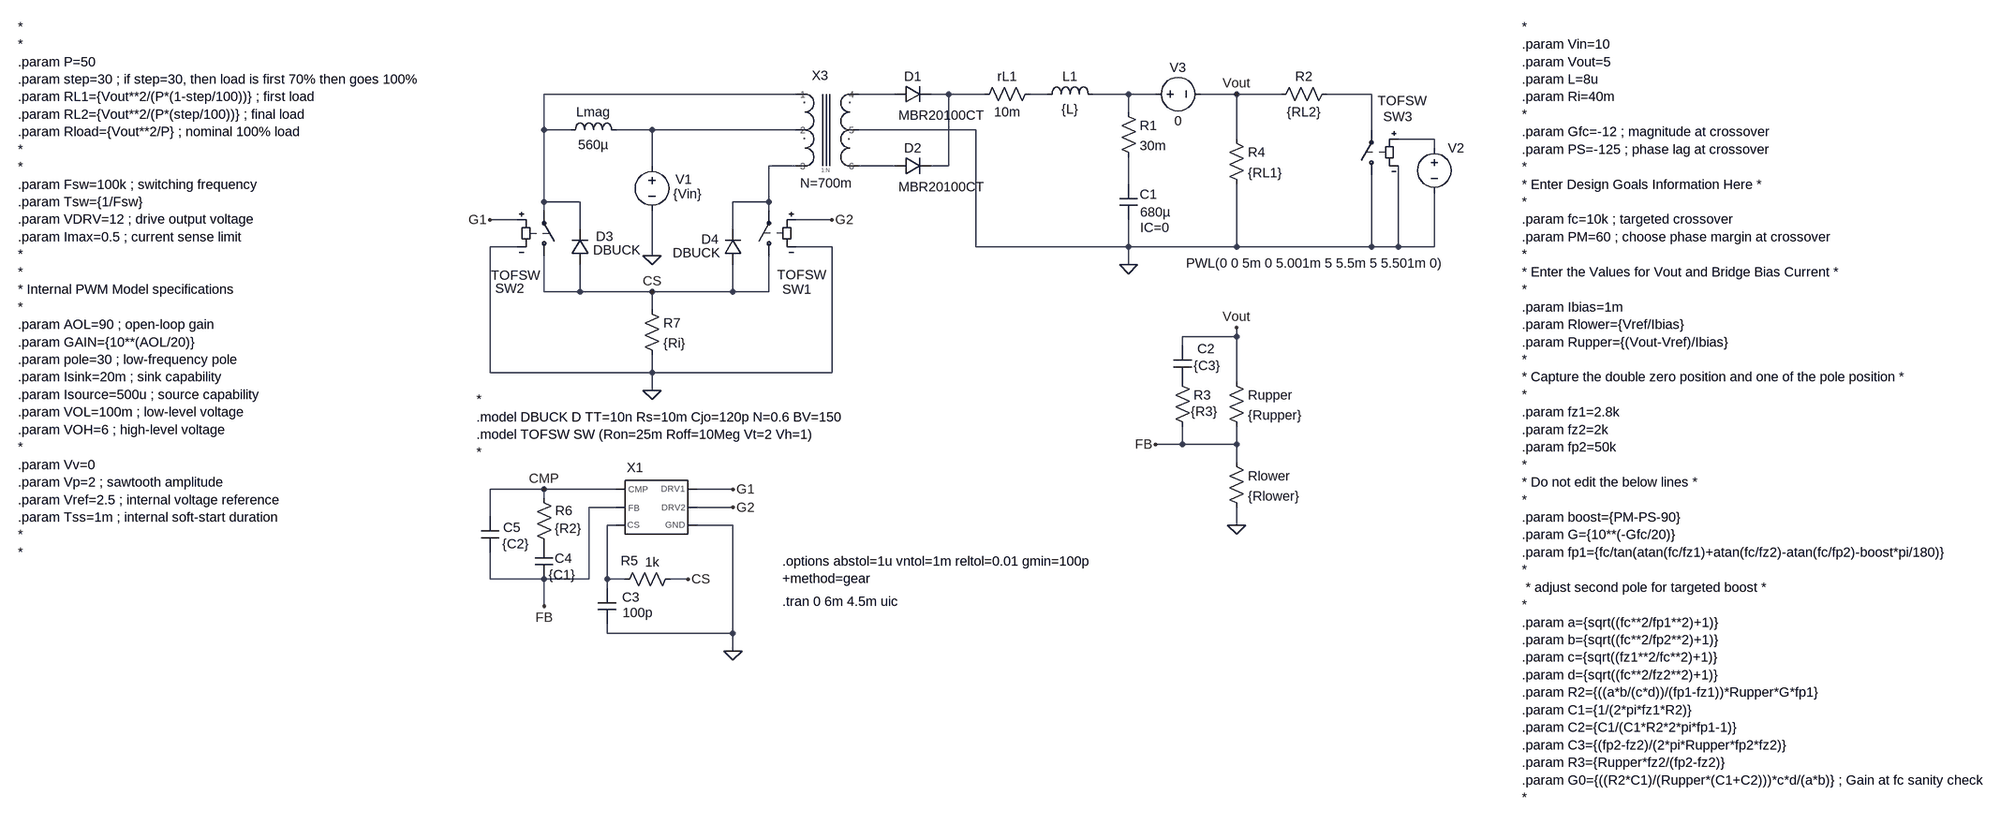
[diagram p0: schematic Push-pull VM - cbc - load step.asc]
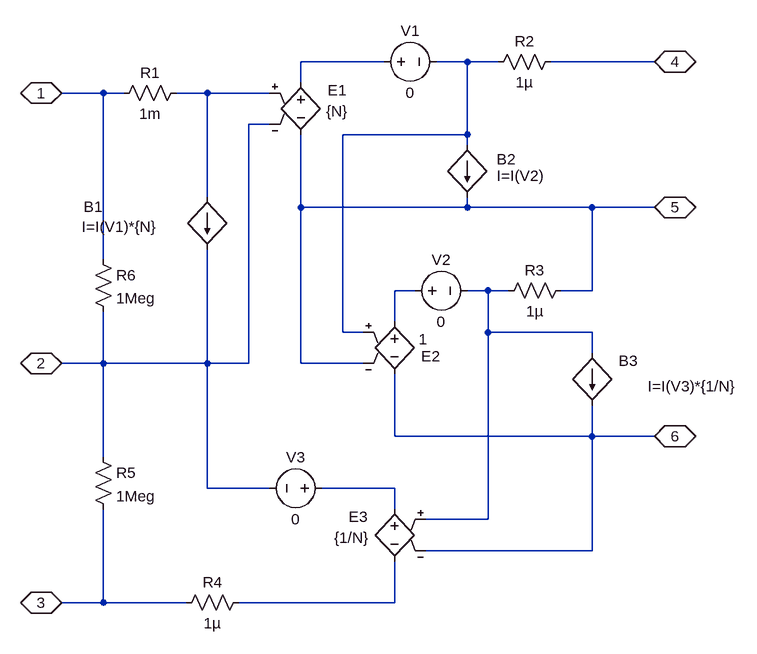
[diagram p1: sub-circuit xfmr_ctap2.asc]
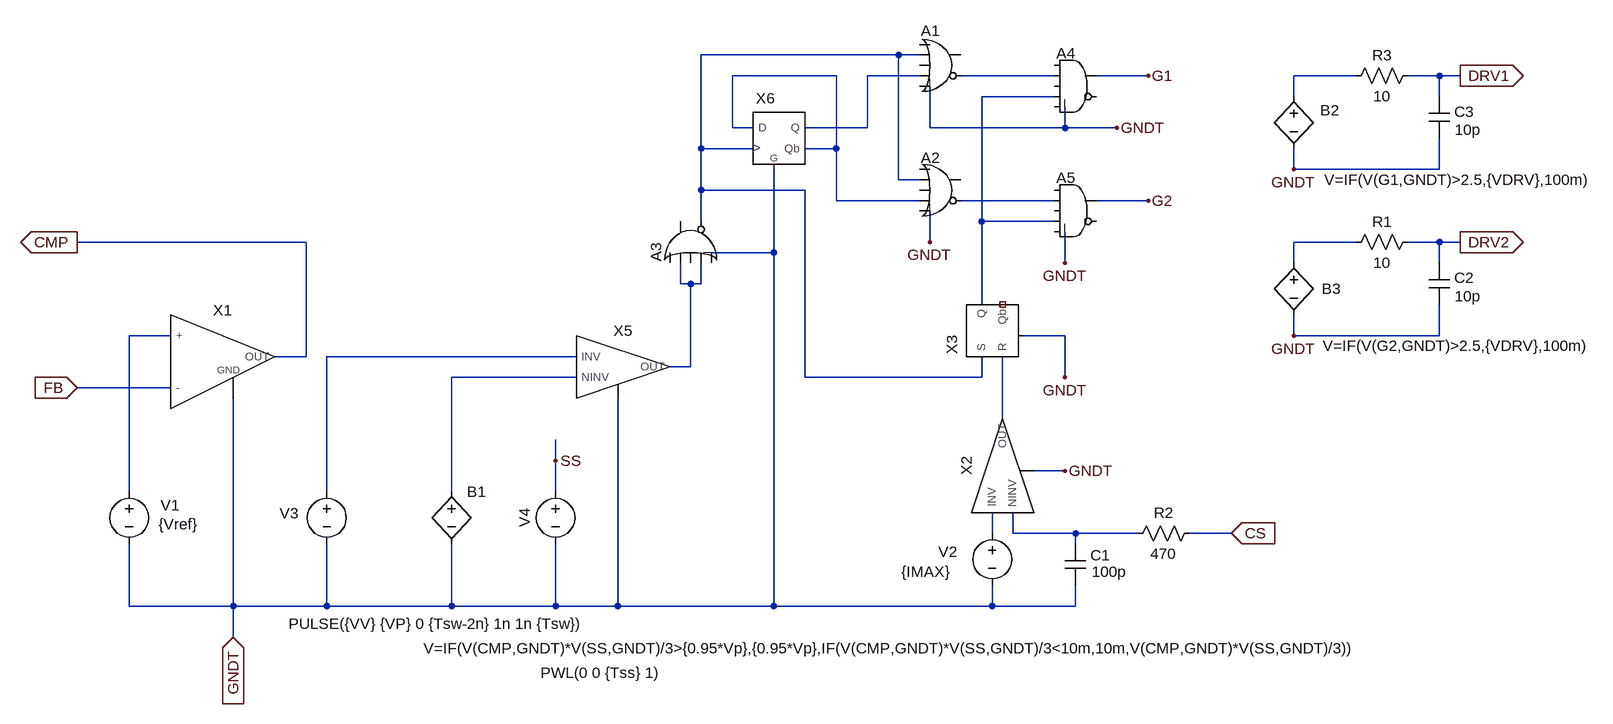
[diagram p2: sub-circuit generic_push_vm_pwm.asc]
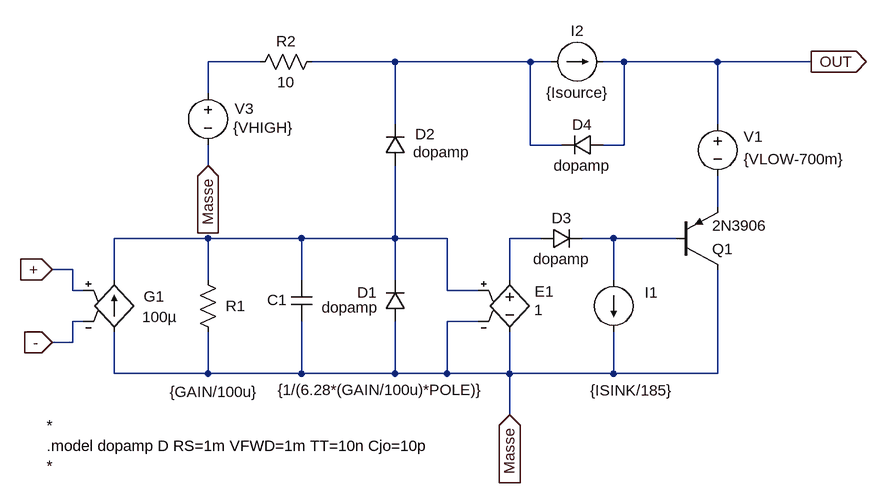
[diagram p3: sub-circuit op_amp_fan_out.asc]
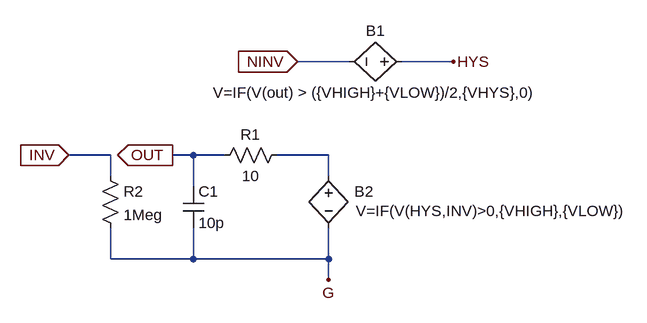
[diagram p4: sub-circuit comptof_g.asc]
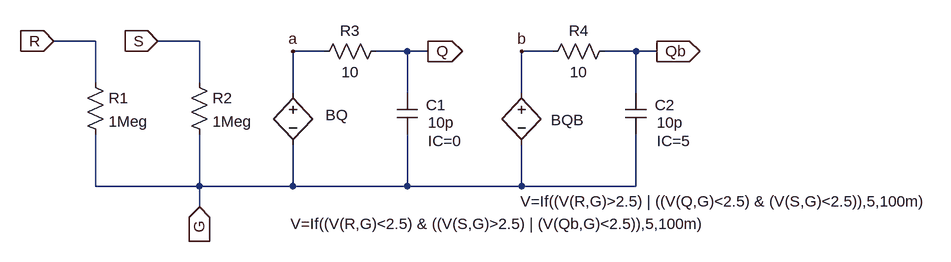
[diagram p5: sub-circuit sr_latch_g.asc]
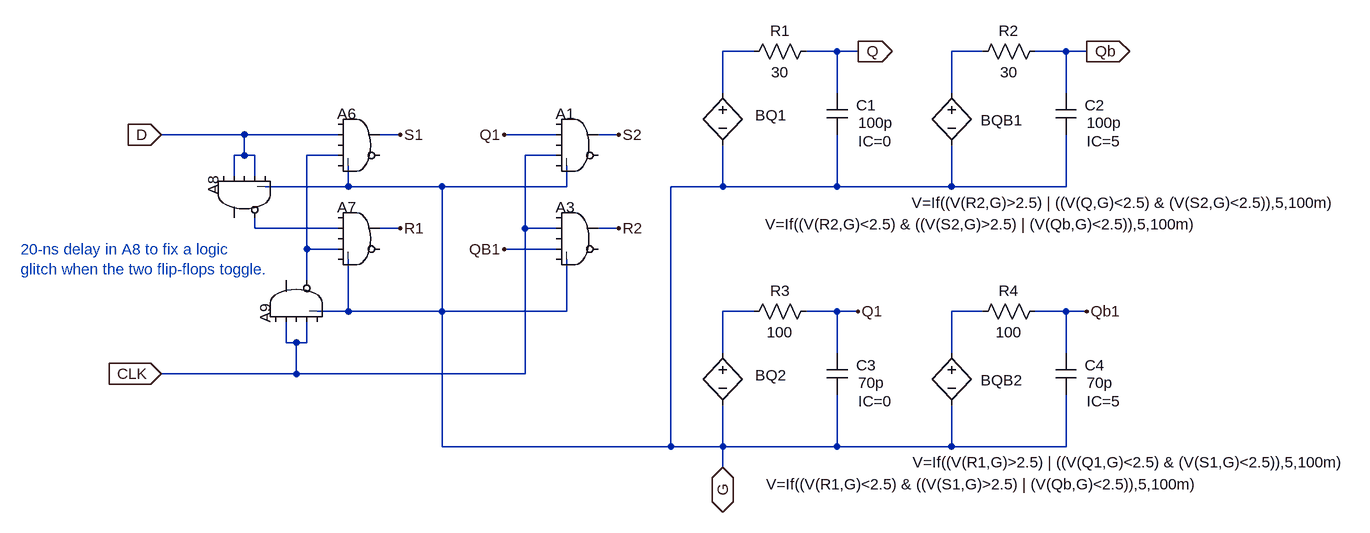
[diagram p6: sub-circuit d_flipflop_g.asc]
Push-pull VM - cbc - load step.asc, the LTspice schematic file:
Version 4.1
SHEET 1 2472 1388
WIRE 32 -64 -416 -64
WIRE 208 -64 144 -64
WIRE 304 -64 272 -64
WIRE 368 -64 304 -64
WIRE 480 -64 448 -64
WIRE 624 -64 560 -64
WIRE 672 -64 624 -64
WIRE 816 -64 752 -64
WIRE 896 -64 816 -64
WIRE 1056 -64 976 -64
WIRE 624 -32 624 -64
WIRE -416 0 -416 -64
WIRE -368 0 -416 0
WIRE -224 0 -288 0
WIRE 32 0 -224 0
WIRE 352 0 144 0
WIRE 1056 0 1056 -64
WIRE 816 16 816 -64
WIRE 1168 16 1104 16
WIRE 1168 32 1168 16
WIRE -224 64 -224 0
WIRE 32 64 -16 64
WIRE 208 64 144 64
WIRE 304 64 304 -64
WIRE 304 64 272 64
WIRE 624 96 624 48
WIRE -416 128 -416 0
WIRE -352 128 -416 128
WIRE -16 128 -16 64
WIRE -16 128 -80 128
WIRE -416 144 -416 128
WIRE -16 144 -16 128
WIRE -464 160 -512 160
WIRE 96 160 32 160
WIRE -352 176 -352 128
WIRE -80 176 -80 128
WIRE -464 208 -512 208
WIRE 96 208 32 208
WIRE 352 208 352 0
WIRE 624 208 624 160
WIRE 624 208 352 208
WIRE 816 208 816 96
WIRE 816 208 624 208
WIRE 1056 208 1056 80
WIRE 1056 208 816 208
WIRE 1104 208 1104 64
WIRE 1104 208 1056 208
WIRE 1168 208 1168 112
WIRE 1168 208 1104 208
WIRE -224 224 -224 144
WIRE 624 240 624 208
WIRE -416 288 -416 224
WIRE -352 288 -352 240
WIRE -352 288 -416 288
WIRE -224 288 -352 288
WIRE -80 288 -80 240
WIRE -80 288 -224 288
WIRE -16 288 -16 224
WIRE -16 288 -80 288
WIRE -224 320 -224 288
WIRE 816 368 816 352
WIRE 816 368 720 368
WIRE 720 384 720 368
WIRE -512 432 -512 208
WIRE -224 432 -224 400
WIRE -224 432 -512 432
WIRE 96 432 96 208
WIRE 96 432 -224 432
WIRE 816 448 816 368
WIRE -224 464 -224 432
WIRE 720 560 720 528
WIRE 720 560 672 560
WIRE 816 560 816 528
WIRE 816 560 720 560
WIRE 816 592 816 560
WIRE -416 640 -512 640
WIRE -288 640 -416 640
WIRE -80 640 -144 640
WIRE -416 656 -416 640
WIRE -288 672 -336 672
WIRE -80 672 -144 672
WIRE -512 688 -512 640
WIRE -288 704 -304 704
WIRE -80 704 -144 704
WIRE 816 704 816 672
WIRE -512 800 -512 752
WIRE -416 800 -512 800
WIRE -336 800 -336 672
WIRE -336 800 -416 800
WIRE -304 800 -304 704
WIRE -272 800 -304 800
WIRE -160 800 -192 800
WIRE -304 816 -304 800
WIRE -416 848 -416 800
WIRE -304 896 -304 880
WIRE -80 896 -80 704
WIRE -80 896 -304 896
WIRE -80 928 -80 896
FLAG 816 704 0
FLAG 816 352 Vout
FLAG 624 240 0
FLAG -224 224 0
FLAG -512 160 G1
FLAG 96 160 G2
FLAG 816 -64 Vout
FLAG -416 848 FB
FLAG -80 928 0
FLAG -416 640 CMP
FLAG -224 464 0
FLAG -80 640 G1
FLAG -80 672 G2
FLAG -224 288 CS
FLAG -160 800 CS
FLAG 672 560 FB
SYMBOL sw -16 240 R180
WINDOW 3 -102 -18 Left 2
WINDOW 0 -76 -44 Left 2
SYMATTR Value TOFSW
SYMATTR InstName SW1
SYMBOL voltage -224 48 R0
WINDOW 0 42 40 Left 2
WINDOW 3 38 66 Left 2
SYMATTR InstName V1
SYMATTR Value {Vin}
SYMBOL diode 208 -48 R270
WINDOW 0 32 32 VTop 2
WINDOW 3 -6 83 VBottom 2
SYMATTR InstName D1
SYMATTR Value MBR20100CT
SYMBOL res 464 -80 R90
WINDOW 0 0 56 VBottom 2
WINDOW 3 32 56 VTop 2
SYMATTR InstName rL1
SYMATTR Value 10m
SYMBOL ind 464 -48 R270
WINDOW 0 32 56 VTop 2
WINDOW 3 5 56 VBottom 2
SYMATTR InstName L1
SYMATTR Value {L}
SYMBOL res 608 -48 R0
SYMATTR InstName R1
SYMATTR Value 30m
SYMBOL cap 608 96 R0
WINDOW 0 36 19 Left 2
WINDOW 3 37 50 Left 2
WINDOW 123 37 78 Left 2
SYMATTR InstName C1
SYMATTR Value 680µ
SYMATTR Value2 IC=0
SYMBOL res 800 576 R0
SYMATTR InstName Rlower
SYMATTR Value {Rlower}
SYMBOL res 800 432 R0
SYMATTR InstName Rupper
SYMATTR Value {Rupper}
SYMBOL cap 704 384 R0
WINDOW 0 42 6 Left 2
WINDOW 3 36 36 Left 2
SYMATTR InstName C2
SYMATTR Value {C3}
SYMBOL res 704 432 R0
WINDOW 3 31 69 Left 2
SYMATTR Value {R3}
SYMATTR InstName R3
SYMBOL sw -416 240 M180
WINDOW 3 -7 -19 Right 2
WINDOW 0 -35 -42 Right 2
SYMATTR Value TOFSW
SYMATTR InstName SW2
SYMBOL diode 208 80 R270
WINDOW 0 32 32 VTop 2
WINDOW 3 -6 83 VBottom 2
SYMATTR InstName D2
SYMATTR Value MBR20100CT
SYMBOL diode -336 240 R180
WINDOW 0 -43 50 Left 2
WINDOW 3 -91 26 Left 2
SYMATTR InstName D3
SYMATTR Value DBUCK
SYMBOL diode -64 240 R180
WINDOW 0 41 45 Left 2
WINDOW 3 40 21 Left 2
SYMATTR InstName D4
SYMATTR Value DBUCK
SYMBOL ind -272 16 M270
WINDOW 0 32 56 VTop 2
WINDOW 3 5 56 VBottom 2
SYMATTR InstName Lmag
SYMATTR Value 560µ
SYMBOL res 800 0 R0
SYMATTR InstName R4
SYMATTR Value {RL1}
SYMBOL res -176 784 R90
WINDOW 0 -1 88 VBottom 2
WINDOW 3 -30 47 VTop 2
SYMATTR InstName R5
SYMATTR Value 1k
SYMBOL cap -320 816 R0
WINDOW 0 43 16 Left 2
WINDOW 3 44 44 Left 2
SYMATTR InstName C3
SYMATTR Value 100p
SYMBOL cap -432 736 R0
WINDOW 0 35 27 Left 2
SYMATTR InstName C4
SYMATTR Value {C1}
SYMBOL res -432 640 R0
WINDOW 0 36 38 Left 2
WINDOW 3 35 70 Left 2
SYMATTR InstName R6
SYMATTR Value {R2}
SYMBOL cap -528 688 R0
WINDOW 0 39 20 Left 2
WINDOW 3 38 49 Left 2
SYMATTR InstName C5
SYMATTR Value {C2}
SYMBOL res -240 304 R0
SYMATTR InstName R7
SYMATTR Value {Ri}
SYMBOL res 992 -80 R90
WINDOW 0 0 56 VBottom 2
WINDOW 3 32 56 VTop 2
SYMATTR InstName R2
SYMATTR Value {RL2}
SYMBOL sw 1056 96 R180
WINDOW 3 -98 148 Left 2
WINDOW 0 -73 120 Left 2
SYMATTR Value TOFSW
SYMATTR InstName SW3
SYMBOL voltage 1168 16 R0
WINDOW 3 -442 221 Left 2
WINDOW 123 0 0 Left 0
WINDOW 39 0 0 Left 0
SYMATTR Value PWL(0 0 5m 0 5.001m 5 5.5m 5 5.501m 0)
SYMATTR InstName V2
SYMBOL voltage 656 -64 R270
WINDOW 0 32 56 VTop 2
WINDOW 3 -32 56 VBottom 2
SYMATTR InstName V3
SYMATTR Value 0
SYMBOL TOF\\Subcircuits\\XFMR_CTap2 96 -16 R0
WINDOW 39 -10 126 Bottom 2
SYMATTR InstName X3
SYMATTR SpiceLine N=700m
SYMBOL TOF\\Subcircuits\\Generic_PUSH_VM_PWM -224 640 R0
WINDOW 0 -30 -23 Bottom 2
SYMATTR InstName X1
SYMATTR SpiceLine gain={gain} pole={pole} Isink={Isink} Isource={Isource} Vlow={VOL} Vhigh={VOH} Vv={Vv} Vp={Vp} Vref={Vref} Tss={Tss} Vdrv={Vdrv} Imax={Imax}
TEXT 1424 -184 Left 2 !*\n.param Vin=10\n.param Vout=5\n.param L=8u\n.param Ri=40m\n*\n.param Gfc=-12 ; magnitude at crossover\n.param PS=-125 ; phase lag at crossover\n*\n* Enter Design Goals Information Here *\n*\n.param fc=10k ; targeted crossover\n.param PM=60 ; choose phase margin at crossover\n*\n* Enter the Values for Vout and Bridge Bias Current *\n*\n.param Ibias=1m\n.param Rlower={Vref/Ibias}\n.param Rupper={(Vout-Vref)/Ibias}\n*\n* Capture the double zero position and one of the pole position *\n*\n.param fz1=2.8k\n.param fz2=2k\n.param fp2=50k\n*\n* Do not edit the below lines *\n*\n.param boost={PM-PS-90}\n.param G={10**(-Gfc/20)}\n.param fp1={fc/tan(atan(fc/fz1)+atan(fc/fz2)-atan(fc/fp2)-boost*pi/180)}\n*\n * adjust second pole for targeted boost *\n*\n.param a={sqrt((fc**2/fp1**2)+1)}\n.param b={sqrt((fc**2/fp2**2)+1)}\n.param c={sqrt((fz1**2/fc**2)+1)}\n.param d={sqrt((fc**2/fz2**2)+1)}\n.param R2={((a*b/(c*d))/(fp1-fz1))*Rupper*G*fp1}\n.param C1={1/(2*pi*fz1*R2)}\n.param C2={C1/(C1*R2*2*pi*fp1-1)}\n.param C3={(fp2-fz2)/(2*pi*Rupper*fp2*fz2)}\n.param R3={Rupper*fz2/(fp2-fz2)}\n.param G0={((R2*C1)/(Rupper*(C1+C2)))*c*d/(a*b)} ; Gain at fc sanity check\n*
TEXT -1352 -184 Left 2 !*\n*\n.param P=50\n.param step=30 ; if step=30, then load is first 70% then goes 100%\n.param RL1={Vout**2/(P*(1-step/100))} ; first load\n.param RL2={Vout**2/(P*(step/100))} ; final load\n.param Rload={Vout**2/P} ; nominal 100% load\n*\n*\n.param Fsw=100k ; switching frequency\n.param Tsw={1/Fsw}\n.param VDRV=12 ; drive output voltage\n.param Imax=0.5 ; current sense limit\n*\n*\n* Internal PWM Model specifications\n*\n.param AOL=90 ; open-loop gain \n.param GAIN={10**(AOL/20)}\n.param pole=30 ; low-frequency pole\n.param Isink=20m ; sink capability\n.param Isource=500u ; source capability\n.param VOL=100m ; low-level voltage\n.param VOH=6 ; high-level voltage\n*\n.param Vv=0\n.param Vp=2 ; sawtooth amplitude\n.param Vref=2.5 ; internal voltage reference\n.param Tss=1m ; internal soft-start duration\n*\n*
TEXT -536 480 Left 2 !*\n.model DBUCK D TT=10n Rs=10m Cjo=120p N=0.6 BV=150\n.model TOFSW SW (Ron=25m Roff=10Meg Vt=2 Vh=1)\n*
TEXT 8 840 Left 2 !.tran 0 6m 4.5m uic
TEXT 8 768 Left 2 !.options abstol=1u vntol=1m reltol=0.01 gmin=100p\n+method=gear

xfmr_ctap2.asc, the sub-circuit schematic file:
Version 4.1
SHEET 1 880 952
WIRE 336 48 208 48
WIRE 464 48 416 48
WIRE 512 48 464 48
WIRE 752 48 592 48
WIRE 208 80 208 48
WIRE -96 96 -160 96
WIRE -64 96 -96 96
WIRE 64 96 16 96
WIRE 160 96 64 96
WIRE 160 144 128 144
WIRE 464 160 464 48
WIRE 464 160 272 160
WIRE 464 176 464 160
WIRE 64 256 64 96
WIRE 208 272 208 160
WIRE 464 272 464 256
WIRE 464 272 208 272
WIRE 656 272 464 272
WIRE 752 272 656 272
WIRE -96 352 -96 96
WIRE 384 400 352 400
WIRE 496 400 464 400
WIRE 528 400 496 400
WIRE 656 400 656 272
WIRE 656 400 608 400
WIRE 352 448 352 400
WIRE 272 464 272 160
WIRE 304 464 272 464
WIRE 496 464 496 400
WIRE 656 464 496 464
WIRE 656 496 656 464
WIRE -96 512 -96 432
WIRE -96 512 -160 512
WIRE 64 512 64 336
WIRE 64 512 -96 512
WIRE 128 512 128 144
WIRE 128 512 64 512
WIRE 208 512 208 272
WIRE 304 512 208 512
WIRE 352 624 352 528
WIRE 656 624 656 576
WIRE 656 624 352 624
WIRE 752 624 656 624
WIRE -96 656 -96 512
WIRE 64 704 64 512
WIRE 160 704 64 704
WIRE 352 704 240 704
WIRE 352 736 352 704
WIRE 496 752 496 464
WIRE 496 752 400 752
WIRE 656 800 656 624
WIRE 656 800 400 800
WIRE -96 880 -96 736
WIRE -96 880 -160 880
WIRE 32 880 -96 880
WIRE 352 880 352 816
WIRE 352 880 112 880
FLAG -160 96 1
IOPIN -160 96 BiDir
FLAG -160 512 2
IOPIN -160 512 BiDir
FLAG 752 48 4
IOPIN 752 48 BiDir
FLAG 752 272 5
IOPIN 752 272 BiDir
FLAG 752 624 6
IOPIN 752 624 BiDir
FLAG -160 880 3
IOPIN -160 880 BiDir
SYMBOL res 32 80 R90
WINDOW 0 0 56 VBottom 2
WINDOW 3 32 56 VTop 2
SYMATTR InstName R1
SYMATTR Value 1m
SYMBOL e 208 64 R0
WINDOW 0 41 28 Left 2
WINDOW 3 39 60 Left 2
SYMATTR InstName E1
SYMATTR Value {N}
SYMBOL voltage 320 48 R270
WINDOW 0 32 56 VTop 2
WINDOW 3 -32 56 VBottom 2
SYMATTR InstName V1
SYMATTR Value 0
SYMBOL res 608 32 R90
WINDOW 0 0 56 VBottom 2
WINDOW 3 32 56 VTop 2
SYMATTR InstName R2
SYMATTR Value 1µ
SYMBOL bi 64 256 R0
WINDOW 0 -190 15 Left 2
WINDOW 3 -193 46 Left 2
SYMATTR InstName B1
SYMATTR Value I=I(V1)*{N}
SYMBOL e 352 432 R0
WINDOW 0 41 69 Left 2
WINDOW 3 37 43 Left 2
SYMATTR InstName E2
SYMATTR Value 1
SYMBOL voltage 368 400 R270
WINDOW 0 32 56 VTop 2
WINDOW 3 -32 56 VBottom 2
SYMATTR InstName V2
SYMATTR Value 0
SYMBOL res 624 384 R90
WINDOW 0 0 56 VBottom 2
WINDOW 3 32 56 VTop 2
SYMATTR InstName R3
SYMATTR Value 1µ
SYMBOL bi 464 176 R0
WINDOW 0 45 22 Left 2
WINDOW 3 45 47 Left 2
SYMATTR InstName B2
SYMATTR Value I=I(V2)
SYMBOL e 352 720 M0
WINDOW 0 41 28 Left 2
WINDOW 3 39 60 Left 2
SYMATTR InstName E3
SYMATTR Value {1/N}
SYMBOL voltage 256 704 R90
WINDOW 0 -32 56 VBottom 2
WINDOW 3 32 56 VTop 2
SYMATTR InstName V3
SYMATTR Value 0
SYMBOL res 128 864 R90
WINDOW 0 0 56 VBottom 2
WINDOW 3 32 56 VTop 2
SYMATTR InstName R4
SYMATTR Value 1µ
SYMBOL bi 656 496 M0
WINDOW 0 -70 12 Left 2
WINDOW 3 -222 51 Left 2
SYMATTR InstName B3
SYMATTR Value I=I(V3)*{1/N}
SYMBOL res -112 640 R0
SYMATTR InstName R5
SYMATTR Value 1Meg
SYMBOL res -112 336 R0
SYMATTR InstName R6
SYMATTR Value 1Meg

generic_push_vm_pwm.asc, the sub-circuit schematic file:
Version 4.1
SHEET 1 896 1692
WIRE -208 -736 -512 -736
WIRE -176 -736 -208 -736
WIRE -304 -704 -464 -704
WIRE -176 -704 -256 -704
WIRE 32 -704 -112 -704
WIRE 176 -704 96 -704
WIRE 496 -704 400 -704
WIRE 624 -704 576 -704
WIRE 656 -704 624 -704
WIRE 32 -672 -80 -672
WIRE 400 -672 400 -704
WIRE 624 -672 624 -704
WIRE -464 -624 -464 -704
WIRE -432 -624 -464 -624
WIRE -256 -624 -256 -704
WIRE -256 -624 -352 -624
WIRE -160 -624 -160 -688
WIRE 48 -624 48 -656
WIRE 48 -624 -160 -624
WIRE 128 -624 48 -624
WIRE -512 -592 -512 -736
WIRE -432 -592 -512 -592
WIRE -304 -592 -304 -704
WIRE -304 -592 -352 -592
WIRE 400 -560 400 -592
WIRE 624 -560 624 -608
WIRE 624 -560 400 -560
WIRE -208 -544 -208 -736
WIRE -176 -544 -208 -544
WIRE -512 -528 -512 -592
WIRE -352 -528 -512 -528
WIRE -304 -512 -304 -592
WIRE -176 -512 -304 -512
WIRE 32 -512 -112 -512
WIRE 176 -512 96 -512
WIRE -512 -480 -512 -528
WIRE -80 -480 -80 -672
WIRE 32 -480 -80 -480
WIRE -1120 -448 -1472 -448
WIRE -160 -448 -160 -496
WIRE 496 -448 400 -448
WIRE 624 -448 576 -448
WIRE 656 -448 624 -448
WIRE -400 -432 -400 -560
WIRE -400 -432 -496 -432
WIRE 48 -416 48 -464
WIRE 400 -416 400 -448
WIRE 624 -416 624 -448
WIRE -544 -384 -544 -416
WIRE -528 -384 -544 -384
WIRE -512 -384 -512 -416
WIRE -512 -384 -528 -384
WIRE -80 -352 -80 -480
WIRE -1328 -304 -1392 -304
WIRE 48 -304 -16 -304
WIRE 400 -304 400 -336
WIRE 624 -304 624 -352
WIRE 624 -304 400 -304
WIRE -1120 -272 -1120 -448
WIRE -1120 -272 -1168 -272
WIRE -704 -272 -1088 -272
WIRE -528 -256 -528 -384
WIRE -528 -256 -560 -256
WIRE -704 -240 -896 -240
WIRE -352 -240 -352 -528
WIRE -80 -240 -80 -272
WIRE -80 -240 -352 -240
WIRE 48 -240 48 -304
WIRE -1328 -224 -1472 -224
WIRE -48 -176 -48 -272
WIRE -736 -112 -736 -144
WIRE 48 -96 0 -96
WIRE -1392 -64 -1392 -304
WIRE -1088 -64 -1088 -272
WIRE -896 -64 -896 -240
WIRE -736 -64 -736 -112
WIRE -64 0 -64 -32
WIRE -32 0 -32 -32
WIRE 64 0 -32 0
WIRE 160 0 64 0
WIRE 304 0 240 0
WIRE 64 16 64 0
WIRE -1392 112 -1392 16
WIRE -1232 112 -1232 -208
WIRE -1232 112 -1392 112
WIRE -1088 112 -1088 16
WIRE -1088 112 -1232 112
WIRE -896 112 -896 16
WIRE -896 112 -1088 112
WIRE -736 112 -736 16
WIRE -736 112 -896 112
WIRE -640 112 -640 -208
WIRE -640 112 -736 112
WIRE -400 112 -400 -432
WIRE -400 112 -640 112
WIRE -64 112 -64 80
WIRE -64 112 -400 112
WIRE 64 112 64 80
WIRE 64 112 -64 112
WIRE -1232 160 -1232 112
FLAG -1472 -448 CMP
IOPIN -1472 -448 Out
FLAG -1472 -224 FB
IOPIN -1472 -224 In
FLAG 304 0 CS
IOPIN 304 0 In
FLAG -1232 160 GNDT
IOPIN -1232 160 In
FLAG 48 -96 GNDT
FLAG 176 -704 G1
FLAG 176 -512 G2
FLAG -736 -112 SS
FLAG 128 -624 GNDT
FLAG 48 -416 GNDT
FLAG -160 -448 GNDT
FLAG 48 -240 GNDT
FLAG 400 -304 GNDT
FLAG 400 -560 GNDT
FLAG 656 -448 DRV2
IOPIN 656 -448 Out
FLAG 656 -704 DRV1
IOPIN 656 -704 Out
SYMBOL op_amp_fan_out -1248 -272 R0
SYMATTR InstName X1
SYMATTR SpiceLine gain={gain} pole={pole} Isink={Isink} Isource={Isource} Vlow={VOL} Vhigh={VOH}
SYMBOL voltage -1392 -80 R0
WINDOW 0 48 37 Left 2
WINDOW 3 45 66 Left 2
SYMATTR InstName V1
SYMATTR Value {Vref}
SYMBOL voltage -64 -16 R0
WINDOW 0 -83 44 Left 2
WINDOW 3 -140 75 Left 2
SYMATTR InstName V2
SYMATTR Value {IMAX}
SYMBOL voltage -1088 -80 R0
WINDOW 0 -73 49 Left 2
WINDOW 3 -59 219 Left 2
WINDOW 123 0 0 Left 0
WINDOW 39 0 0 Left 0
SYMATTR InstName V3
SYMATTR Value PULSE({VV} {VP} 0 {Tsw-2n} 1n 1n {Tsw})
SYMBOL Digital\\or -144 -784 R0
WINDOW 0 -30 11 Left 2
SYMATTR InstName A1
SYMATTR SpiceLine Vhigh=5 Vlow=0 Ref=2.5
SYMBOL Digital\\or -144 -592 R0
WINDOW 0 -30 14 Left 2
SYMATTR InstName A2
SYMATTR SpiceLine Vhigh=5 Vlow=0 Ref=2.5
SYMBOL bv -896 -80 R0
WINDOW 3 -43 257 Left 2
SYMATTR Value V=IF(V(CMP,GNDT)*V(SS,GNDT)/3>{0.95*Vp},{0.95*Vp},IF(V(CMP,GNDT)*V(SS,GNDT)/3<10m,10m,V(CMP,GNDT)*V(SS,GNDT)/3))
SYMATTR InstName B1
SYMBOL Digital\\or -592 -448 R270
WINDOW 0 -30 11 Left 2
SYMATTR InstName A3
SYMATTR SpiceLine Vhigh=5 Vlow=0 Ref=2.5
SYMBOL Digital\\and 64 -752 R0
WINDOW 0 -29 13 Left 2
SYMATTR InstName A4
SYMATTR SpiceLine Vhigh=5 Vlow=100m Ref=2.5
SYMBOL Digital\\and 64 -560 R0
WINDOW 0 -29 13 Left 2
SYMATTR InstName A5
SYMATTR SpiceLine Vhigh=5 Vlow=100m Ref=2.5
SYMBOL voltage -736 -80 R0
WINDOW 0 -32 56 VBottom 2
WINDOW 3 69 279 Top 2
WINDOW 123 0 0 Left 0
WINDOW 39 0 0 Left 0
SYMATTR InstName V4
SYMATTR Value PWL(0 0 {Tss} 1)
SYMBOL res 256 -16 R90
WINDOW 0 0 56 VBottom 2
WINDOW 3 32 56 VTop 2
SYMATTR InstName R2
SYMATTR Value 470
SYMBOL cap 48 16 R0
WINDOW 0 39 18 Left 2
WINDOW 3 41 43 Left 2
SYMATTR InstName C1
SYMATTR Value 100p
SYMBOL bv 400 -688 R0
WINDOW 0 41 37 Left 2
WINDOW 3 47 144 Left 2
SYMATTR InstName B2
SYMATTR Value V=IF(V(G1,GNDT)>2.5,{VDRV},100m)
SYMBOL bv 400 -432 R0
WINDOW 0 43 56 Left 2
WINDOW 3 45 143 Left 2
SYMATTR InstName B3
SYMATTR Value V=IF(V(G2,GNDT)>2.5,{VDRV},100m)
SYMBOL res 592 -464 R90
WINDOW 0 0 56 VBottom 2
WINDOW 3 32 56 VTop 2
SYMATTR InstName R1
SYMATTR Value 10
SYMBOL cap 608 -416 R0
WINDOW 0 39 23 Left 2
WINDOW 3 40 51 Left 2
SYMATTR InstName C2
SYMATTR Value 10p
SYMBOL res 592 -720 R90
WINDOW 0 0 56 VBottom 2
WINDOW 3 32 56 VTop 2
SYMATTR InstName R3
SYMATTR Value 10
SYMBOL cap 608 -672 R0
WINDOW 0 39 23 Left 2
WINDOW 3 40 51 Left 2
SYMATTR InstName C3
SYMATTR Value 10p
SYMBOL TOF\\Subcircuits\\COMPTOF_G -640 -256 R0
SYMATTR InstName X5
SYMATTR SpiceLine VHIGH=5 VLOW=100m VHYS=10m
SYMBOL TOF\\Subcircuits\\COMPTOF_G -48 -96 R270
SYMATTR InstName X2
SYMATTR SpiceLine VHIGH=5 VLOW=100m VHYS=50m
SYMBOL TOF\\Subcircuits\\SR_latch_G -64 -304 R270
WINDOW 0 -14 -46 Bottom 2
SYMATTR InstName X3
SYMBOL TOF\\Subcircuits\\D_FlipFlop_G -400 -608 R0
WINDOW 0 -13 -46 Bottom 2
SYMATTR InstName X6

op_amp_fan_out.asc, the sub-circuit schematic file:
Version 4.1
SHEET 1 1504 680
WIRE 96 -224 16 -224
WIRE 304 -224 176 -224
WIRE 512 -224 304 -224
WIRE 544 -224 512 -224
WIRE 656 -224 624 -224
WIRE 800 -224 656 -224
WIRE 944 -224 800 -224
WIRE 16 -176 16 -224
WIRE 304 -128 304 -224
WIRE 800 -128 800 -224
WIRE 512 -96 512 -224
WIRE 560 -96 512 -96
WIRE 656 -96 656 -224
WIRE 656 -96 624 -96
WIRE 16 -64 16 -96
WIRE 800 0 800 -48
WIRE 16 48 -128 48
WIRE 160 48 16 48
WIRE 304 48 304 -64
WIRE 304 48 160 48
WIRE 384 48 304 48
WIRE 528 48 480 48
WIRE 640 48 592 48
WIRE 736 48 640 48
WIRE -192 96 -224 96
WIRE -128 112 -128 48
WIRE 16 112 16 48
WIRE 160 112 160 48
WIRE 304 112 304 48
WIRE 480 112 480 48
WIRE 640 112 640 48
WIRE -192 128 -192 96
WIRE -176 128 -192 128
WIRE 384 128 384 48
WIRE 432 128 384 128
WIRE -176 176 -192 176
WIRE 432 176 384 176
WIRE -192 208 -192 176
WIRE -192 208 -224 208
WIRE -128 256 -128 192
WIRE 16 256 16 192
WIRE 16 256 -128 256
WIRE 160 256 160 176
WIRE 160 256 16 256
WIRE 304 256 304 176
WIRE 304 256 160 256
WIRE 384 256 384 176
WIRE 384 256 304 256
WIRE 480 256 480 192
WIRE 480 256 384 256
WIRE 640 256 640 192
WIRE 640 256 480 256
WIRE 800 256 800 96
WIRE 800 256 640 256
WIRE 480 320 480 256
FLAG -224 96 +
IOPIN -224 96 In
FLAG -224 208 -
IOPIN -224 208 In
FLAG 944 -224 OUT
IOPIN 944 -224 Out
FLAG 480 320 Masse
IOPIN 480 320 In
FLAG 16 -64 Masse
IOPIN 16 -64 In
DATAFLAG 800 -16 ""
SYMBOL g -128 96 R0
WINDOW 0 45 41 Left 2
WINDOW 3 43 73 Left 2
SYMATTR InstName G1
SYMATTR Value 100µ
SYMBOL res 0 96 R0
WINDOW 0 43 56 Left 2
WINDOW 3 -43 188 Left 2
SYMATTR InstName R1
SYMATTR Value {GAIN/100u}
SYMBOL cap 144 112 R0
WINDOW 0 -37 31 Left 2
WINDOW 3 -21 169 Left 2
SYMATTR InstName C1
SYMATTR Value {1/(6.28*(GAIN/100u)*POLE)}
SYMBOL diode 320 176 R180
WINDOW 0 44 45 Left 2
WINDOW 3 41 22 Left 2
SYMATTR InstName D1
SYMATTR Value dopamp
SYMBOL e 480 96 R0
WINDOW 0 39 34 Left 2
WINDOW 3 38 62 Left 2
SYMATTR InstName E1
SYMATTR Value 1
SYMBOL diode 528 64 R270
WINDOW 0 32 32 VTop 2
WINDOW 3 0 32 VBottom 2
SYMATTR InstName D3
SYMATTR Value dopamp
SYMBOL current 640 112 R0
WINDOW 0 48 19 Left 2
WINDOW 3 -36 170 Left 2
SYMATTR InstName I1
SYMATTR Value {ISINK/185}
SYMBOL pnp 736 96 M180
SYMATTR InstName Q1
SYMATTR Value 2N3906
SYMBOL voltage 800 -144 R0
WINDOW 0 40 35 Left 2
WINDOW 3 40 70 Left 2
SYMATTR InstName V1
SYMATTR Value {VLOW-700m}
SYMBOL current 544 -224 R270
WINDOW 0 32 40 VTop 2
WINDOW 3 -32 40 VBottom 2
SYMATTR InstName I2
SYMATTR Value {Isource}
SYMBOL diode 624 -80 M270
WINDOW 0 32 32 VTop 2
WINDOW 3 0 32 VBottom 2
SYMATTR InstName D4
SYMATTR Value dopamp
SYMBOL voltage 16 -192 R0
WINDOW 0 41 40 Left 2
WINDOW 3 39 69 Left 2
SYMATTR InstName V3
SYMATTR Value {VHIGH}
SYMBOL diode 288 -64 M180
WINDOW 0 47 49 Left 2
WINDOW 3 44 21 Left 2
SYMATTR InstName D2
SYMATTR Value dopamp
SYMBOL res 192 -240 R90
WINDOW 0 0 56 VBottom 2
WINDOW 3 32 56 VTop 2
SYMATTR InstName R2
SYMATTR Value 10
TEXT -232 336 Left 2 !*\n.model dopamp D RS=1m VFWD=1m TT=10n Cjo=10p\n*

comptof_g.asc, the sub-circuit schematic file:
Version 4.1
SHEET 1 880 680
WIRE 64 192 -16 192
WIRE 224 192 144 192
WIRE -304 336 -368 336
WIRE -176 336 -208 336
WIRE -128 336 -176 336
WIRE 32 336 -48 336
WIRE -304 368 -304 336
WIRE 32 368 32 336
WIRE -176 384 -176 336
WIRE -304 496 -304 448
WIRE -176 496 -176 448
WIRE -176 496 -304 496
WIRE 32 496 32 448
WIRE 32 496 -176 496
WIRE 32 528 32 496
FLAG -16 192 NINV
IOPIN -16 192 In
FLAG 224 192 HYS
FLAG -208 336 OUT
IOPIN -208 336 Out
FLAG -368 336 INV
IOPIN -368 336 In
FLAG 32 528 G
SYMBOL bv 160 192 R90
WINDOW 0 -32 56 VBottom 2
WINDOW 3 32 56 VTop 2
SYMATTR InstName B1
SYMATTR Value V=IF(V(out) > ({VHIGH}+{VLOW})/2,{VHYS},0)
SYMBOL bv 32 352 R0
WINDOW 0 40 40 Left 2
WINDOW 3 42 70 Left 2
SYMATTR InstName B2
SYMATTR Value V=IF(V(HYS,INV)>0,{VHIGH},{VLOW})
SYMBOL res -32 320 R90
WINDOW 0 0 56 VBottom 2
WINDOW 3 32 56 VTop 2
SYMATTR InstName R1
SYMATTR Value 10
SYMBOL cap -192 384 R0
SYMATTR InstName C1
SYMATTR Value 10p
SYMBOL res -320 352 R0
SYMATTR InstName R2
SYMATTR Value 1Meg

sr_latch_g.asc, the sub-circuit schematic file:
Version 4.1
SHEET 1 1168 680
WIRE -192 48 -256 48
WIRE -32 48 -96 48
WIRE 160 64 112 64
WIRE 288 64 240 64
WIRE 320 64 288 64
WIRE 512 64 464 64
WIRE 640 64 592 64
WIRE 672 64 640 64
WIRE -192 112 -192 48
WIRE -32 112 -32 48
WIRE 112 128 112 64
WIRE 288 128 288 64
WIRE 464 128 464 64
WIRE 640 128 640 64
WIRE -192 272 -192 192
WIRE -32 272 -32 192
WIRE -32 272 -192 272
WIRE 112 272 112 208
WIRE 112 272 -32 272
WIRE 288 272 288 192
WIRE 288 272 112 272
WIRE 464 272 464 208
WIRE 464 272 288 272
WIRE 640 272 640 192
WIRE 640 272 464 272
WIRE -32 304 -32 272
FLAG -256 48 R
IOPIN -256 48 In
FLAG -96 48 S
IOPIN -96 48 In
FLAG 320 64 Q
IOPIN 320 64 Out
FLAG 672 64 Qb
IOPIN 672 64 Out
FLAG 112 64 a
FLAG 464 64 b
FLAG -32 304 G
IOPIN -32 304 In
SYMBOL bv 112 112 R0
WINDOW 0 50 50 Left 2
WINDOW 3 -4 218 Left 2
SYMATTR InstName BQ
SYMATTR Value V=If((V(R,G)<2.5) & ((V(S,G)>2.5) | (V(Qb,G)<2.5)),5,100m)
SYMBOL res -208 96 R0
SYMATTR InstName R1
SYMATTR Value 1Meg
SYMBOL res -48 96 R0
SYMATTR InstName R2
SYMATTR Value 1Meg
SYMBOL res 256 48 R90
WINDOW 0 0 56 VBottom 2
WINDOW 3 32 56 VTop 2
SYMATTR InstName R3
SYMATTR Value 10
SYMBOL cap 272 128 R0
WINDOW 0 45 19 Left 2
WINDOW 3 48 46 Left 2
WINDOW 123 48 74 Left 2
SYMATTR InstName C1
SYMATTR Value 10p
SYMATTR Value2 IC=0
SYMBOL bv 464 112 R0
WINDOW 0 45 58 Left 2
WINDOW 3 -2 183 Left 2
SYMATTR InstName BQB
SYMATTR Value V=If((V(R,G)>2.5) | ((V(Q,G)<2.5) & (V(S,G)<2.5)),5,100m)
SYMBOL res 608 48 R90
WINDOW 0 0 56 VBottom 2
WINDOW 3 32 56 VTop 2
SYMATTR InstName R4
SYMATTR Value 10
SYMBOL cap 624 128 R0
WINDOW 0 45 19 Left 2
WINDOW 3 48 46 Left 2
WINDOW 123 48 74 Left 2
SYMATTR InstName C2
SYMATTR Value 10p
SYMATTR Value2 IC=5

d_flipflop_g.asc, the sub-circuit schematic file:
Version 4.1
SHEET 1 1820 1368
WIRE 768 448 720 448
WIRE 896 448 848 448
WIRE 928 448 896 448
WIRE 1120 448 1072 448
WIRE 1248 448 1200 448
WIRE 1280 448 1248 448
WIRE 720 512 720 448
WIRE 896 512 896 448
WIRE 1072 512 1072 448
WIRE 1248 512 1248 448
WIRE -16 576 -144 576
WIRE 128 576 -16 576
WIRE 224 576 192 576
WIRE 464 576 384 576
WIRE 560 576 528 576
WIRE -16 608 -16 576
WIRE -16 608 -32 608
WIRE 0 608 -16 608
WIRE 128 608 80 608
WIRE 464 608 416 608
WIRE -32 640 -32 608
WIRE 0 640 0 608
WIRE 144 656 144 624
WIRE 144 656 16 656
WIRE 288 656 144 656
WIRE 480 656 480 624
WIRE 480 656 288 656
WIRE 720 656 720 592
WIRE 720 656 640 656
WIRE 896 656 896 576
WIRE 896 656 720 656
WIRE 1072 656 1072 592
WIRE 1072 656 896 656
WIRE 1248 656 1248 576
WIRE 1248 656 1072 656
WIRE 0 720 0 704
WIRE 128 720 0 720
WIRE 224 720 192 720
WIRE 416 720 416 608
WIRE 464 720 416 720
WIRE 560 720 528 720
WIRE 80 752 80 608
WIRE 128 752 80 752
WIRE 464 752 384 752
WIRE 80 800 80 752
WIRE 144 848 144 768
WIRE 144 848 96 848
WIRE 288 848 288 656
WIRE 288 848 144 848
WIRE 480 848 480 768
WIRE 480 848 288 848
WIRE 768 848 720 848
WIRE 896 848 848 848
WIRE 928 848 896 848
WIRE 1120 848 1072 848
WIRE 1248 848 1200 848
WIRE 1280 848 1248 848
WIRE 48 896 48 864
WIRE 64 896 48 896
WIRE 80 896 80 864
WIRE 80 896 64 896
WIRE 720 912 720 848
WIRE 896 912 896 848
WIRE 1072 912 1072 848
WIRE 1248 912 1248 848
WIRE 64 944 64 896
WIRE 64 944 -144 944
WIRE 416 944 416 720
WIRE 416 944 64 944
WIRE 288 1056 288 848
WIRE 640 1056 640 656
WIRE 640 1056 288 1056
WIRE 720 1056 720 992
WIRE 720 1056 640 1056
WIRE 896 1056 896 976
WIRE 896 1056 720 1056
WIRE 1072 1056 1072 992
WIRE 1072 1056 896 1056
WIRE 1248 1056 1248 976
WIRE 1248 1056 1072 1056
WIRE 720 1088 720 1056
FLAG -144 576 D
IOPIN -144 576 In
FLAG -144 944 CLK
IOPIN -144 944 In
FLAG 560 576 S2
FLAG 560 720 R2
FLAG 928 448 Q
IOPIN 928 448 Out
FLAG 1280 448 Qb
IOPIN 1280 448 Out
FLAG 224 576 S1
FLAG 224 720 R1
FLAG 384 576 Q1
FLAG 384 752 QB1
FLAG 928 848 Q1
FLAG 1280 848 Qb1
FLAG 720 1088 G
IOPIN 720 1088 BiDir
SYMBOL Digital\\and 496 528 R0
WINDOW 0 -33 16 Left 2
SYMATTR InstName A1
SYMATTR SpiceLine Vhigh=5 Vlow=100m Ref=2.5
SYMBOL Digital\\and 496 672 R0
WINDOW 0 -33 16 Left 2
SYMATTR InstName A3
SYMATTR SpiceLine Vhigh=5 Vlow=100m Ref=2.5
SYMBOL Digital\\and 160 528 R0
WINDOW 0 -33 16 Left 2
SYMATTR InstName A6
SYMATTR SpiceLine Vhigh=5 Vlow=100m Ref=2.5
SYMBOL Digital\\and 160 672 R0
WINDOW 0 -33 16 Left 2
SYMATTR InstName A7
SYMATTR SpiceLine Vhigh=5 Vlow=100m Ref=2.5
SYMBOL Digital\\and -80 672 M90
WINDOW 0 -33 16 Left 2
SYMATTR InstName A8
SYMATTR SpiceLine Vhigh=5 Vlow=100m Ref=2.5 Td=20n
SYMBOL Digital\\and 0 832 R270
WINDOW 0 -33 16 Left 2
SYMATTR InstName A9
SYMATTR SpiceLine Vhigh=5 Vlow=100m Ref=2.5
SYMBOL bv 720 496 R0
WINDOW 0 50 50 Left 2
WINDOW 3 65 218 Left 2
SYMATTR InstName BQ1
SYMATTR Value V=If((V(R2,G)<2.5) & ((V(S2,G)>2.5) | (V(Qb,G)<2.5)),5,100m)
SYMBOL res 864 432 R90
WINDOW 0 0 56 VBottom 2
WINDOW 3 32 56 VTop 2
SYMATTR InstName R1
SYMATTR Value 30
SYMBOL cap 880 512 R0
WINDOW 0 45 19 Left 2
WINDOW 3 48 46 Left 2
WINDOW 123 48 74 Left 2
SYMATTR InstName C1
SYMATTR Value 100p
SYMATTR Value2 IC=0
SYMBOL bv 1072 496 R0
WINDOW 0 45 58 Left 2
WINDOW 3 -61 185 Left 2
SYMATTR InstName BQB1
SYMATTR Value V=If((V(R2,G)>2.5) | ((V(Q,G)<2.5) & (V(S2,G)<2.5)),5,100m)
SYMBOL res 1216 432 R90
WINDOW 0 0 56 VBottom 2
WINDOW 3 32 56 VTop 2
SYMATTR InstName R2
SYMATTR Value 30
SYMBOL cap 1232 512 R0
WINDOW 0 45 19 Left 2
WINDOW 3 48 46 Left 2
WINDOW 123 48 74 Left 2
SYMATTR InstName C2
SYMATTR Value 100p
SYMATTR Value2 IC=5
SYMBOL bv 720 896 R0
WINDOW 0 50 50 Left 2
WINDOW 3 67 218 Left 2
SYMATTR InstName BQ2
SYMATTR Value V=If((V(R1,G)<2.5) & ((V(S1,G)>2.5) | (V(Qb,G)<2.5)),5,100m)
SYMBOL res 864 832 R90
WINDOW 0 0 56 VBottom 2
WINDOW 3 32 56 VTop 2
SYMATTR InstName R3
SYMATTR Value 100
SYMBOL cap 880 912 R0
WINDOW 0 45 19 Left 2
WINDOW 3 48 46 Left 2
WINDOW 123 48 74 Left 2
SYMATTR InstName C3
SYMATTR Value 70p
SYMATTR Value2 IC=0
SYMBOL bv 1072 896 R0
WINDOW 0 45 58 Left 2
WINDOW 3 -60 184 Left 2
SYMATTR InstName BQB2
SYMATTR Value V=If((V(R1,G)>2.5) | ((V(Q1,G)<2.5) & (V(S1,G)<2.5)),5,100m)
SYMBOL res 1216 832 R90
WINDOW 0 0 56 VBottom 2
WINDOW 3 32 56 VTop 2
SYMATTR InstName R4
SYMATTR Value 100
SYMBOL cap 1232 912 R0
WINDOW 0 45 19 Left 2
WINDOW 3 48 46 Left 2
WINDOW 123 48 74 Left 2
SYMATTR InstName C4
SYMATTR Value 70p
SYMATTR Value2 IC=5
TEXT -360 752 Left 2 ;20-ns delay in A8 to fix a logic \nglitch when the two flip-flops toggle.

The netlist it stands for:
* Push-pull VM - cbc - load step.asc
SW1 CS N009 G2 0 TOFSW
V1 N007 0 {Vin}
D1 N002 N003 MBR20100CT
rL1 N004 N003 10m
L1 N004 N005 {L}
R1 N005 N011 30m
C1 N011 0 680µ IC=0
Rlower FB 0 {Rlower}
Rupper Vout FB {Rupper}
C2 Vout P001 {C3}
R3 P001 FB {R3}
SW2 CS N001 G1 0 TOFSW
D2 N010 N003 MBR20100CT
D3 CS N001 DBUCK
D4 CS N009 DBUCK
Lmag N007 N001 560µ
R4 Vout 0 {RL1}
R5 CS N012 1k
C3 N012 0 100p
C4 P002 FB {C1}
R6 CMP P002 {R2}
C5 CMP FB {C2}
R7 CS 0 {Ri}
R2 N006 Vout {RL2}
SW3 0 N006 N008 0 TOFSW
V2 N008 0 PWL(0 0 5m 0 5.001m 5 5.5m 5 5.501m 0)
V3 N005 Vout 0
X§X3 N001 N007 N009 N002 0 N010 xfmr_ctap2 params: N=700m
X§X1 N012 FB 0 CMP G1 G2 generic_push_vm_pwm params: gain={gain} pole={pole} Isink={Isink} Isource={Isource} Vlow={VOL} Vhigh={VOH} Vv={Vv} Vp={Vp} Vref={Vref} Tss={Tss} Vdrv={Vdrv} Imax={Imax}

* block symbol definitions
.subckt xfmr_ctap2 1 2 3 4 5 6
R1 N003 1 1m
E1 N001 5 N003 2 {N}
V1 N001 N002 0
R2 4 N002 1µ
B1 N003 2 I=I(V1)*{N}
E2 N004 6 N002 5 1
V2 N004 N005 0
R3 5 N005 1µ
B2 N002 5 I=I(V2)
E3 N006 N007 N005 6 {1/N}
V3 N006 2 0
R4 N007 3 1µ
B3 N005 6 I=I(V3)*{1/N}
R5 2 3 1Meg
R6 1 2 1Meg
.ends xfmr_ctap2

.subckt generic_push_vm_pwm CS FB GNDT CMP DRV1 DRV2
X§X1 N010 FB GNDT CMP op_amp_fan_out params: gain={gain} pole={pole} Isink={Isink} Isource={Isource} Vlow={VOL} Vhigh={VOH}
V1 N010 GNDT {Vref}
V2 N014 GNDT {IMAX}
V3 N011 GNDT PULSE({VV} {VP} 0 {Tsw-2n} 1n 1n {Tsw})
A1 GNDT N001 GNDT N003 GNDT N004 GNDT GNDT OR Vhigh=5 Vlow=0 Ref=2.5
A2 GNDT N001 GNDT N002 GNDT N007 GNDT GNDT OR Vhigh=5 Vlow=0 Ref=2.5
B1 N012 GNDT V=IF(V(CMP,GNDT)*V(SS,GNDT)/3>{0.95*Vp},{0.95*Vp},IF(V(CMP,GNDT)*V(SS,GNDT)/3<10m,10m,V(CMP,GNDT)*V(SS,GNDT)/3))
A3 GNDT N009 GNDT N009 GNDT N001 GNDT GNDT OR Vhigh=5 Vlow=0 Ref=2.5
A4 GNDT N004 GNDT N006 GNDT GNDT G1 GNDT AND Vhigh=5 Vlow=100m Ref=2.5
A5 GNDT N007 GNDT N006 GNDT GNDT G2 GNDT AND Vhigh=5 Vlow=100m Ref=2.5
V4 SS GNDT PWL(0 0 {Tss} 1)
R2 CS N015 470
C1 N015 GNDT 100p
B2 N005 GNDT V=IF(V(G1,GNDT)>2.5,{VDRV},100m)
B3 N008 GNDT V=IF(V(G2,GNDT)>2.5,{VDRV},100m)
R1 DRV2 N008 10
C2 DRV2 GNDT 10p
R3 DRV1 N005 10
C3 DRV1 GNDT 10p
X§X5 N011 N012 N009 GNDT comptof_g params: VHIGH=5 VLOW=100m VHYS=10m
X§X2 N014 N015 N013 GNDT comptof_g params: VHIGH=5 VLOW=100m VHYS=50m
X§X3 N013 N001 N006 NC_01 GNDT sr_latch_g
X§X6 N002 N001 N003 N002 GNDT d_flipflop_g
.ends generic_push_vm_pwm

.subckt op_amp_fan_out + - Masse OUT
G1 Masse N004 + - 100µ
R1 N004 Masse {GAIN/100u}
C1 N004 Masse {1/(6.28*(GAIN/100u)*POLE)}
D1 Masse N004 dopamp
E1 N005 Masse N004 Masse 1
D3 N005 N006 dopamp
I1 N006 Masse {ISINK/185}
Q1 Masse N006 N003 0 2N3906
V1 OUT N003 {VLOW-700m}
I2 N002 OUT {Isource}
D4 OUT N002 dopamp
V3 N001 Masse {VHIGH}
D2 N004 N002 dopamp
R2 N002 N001 10
*
.model dopamp D RS=1m VFWD=1m TT=10n Cjo=10p
*
.ends op_amp_fan_out

.subckt comptof_g INV NINV OUT G
B1 HYS NINV V=IF(V(out) > ({VHIGH}+{VLOW})/2,{VHYS},0)
B2 N001 G V=IF(V(HYS,INV)>0,{VHIGH},{VLOW})
R1 N001 OUT 10
C1 OUT G 10p
R2 INV G 1Meg
.ends comptof_g

.subckt sr_latch_g R S Q Qb G
BQ a G V=If((V(R,G)<2.5) & ((V(S,G)>2.5) | (V(Qb,G)<2.5)),5,100m)
R1 R G 1Meg
R2 S G 1Meg
R3 Q a 10
C1 Q G 10p IC=0
BQB b G V=If((V(R,G)>2.5) | ((V(Q,G)<2.5) & (V(S,G)<2.5)),5,100m)
R4 Qb b 10
C2 Qb G 10p IC=5
.ends sr_latch_g

.subckt d_flipflop_g D CLK Q Qb G
A1 G Q1 G CLK G G S2 G AND Vhigh=5 Vlow=100m Ref=2.5
A3 G CLK G QB1 G G R2 G AND Vhigh=5 Vlow=100m Ref=2.5
A6 G D G N003 G G S1 G AND Vhigh=5 Vlow=100m Ref=2.5
A7 G N004 G N003 G G R1 G AND Vhigh=5 Vlow=100m Ref=2.5
A8 G D G D G N004 G G AND Vhigh=5 Vlow=100m Ref=2.5 Td=20n
A9 G CLK G CLK G N003 G G AND Vhigh=5 Vlow=100m Ref=2.5
BQ1 N001 G V=If((V(R2,G)<2.5) & ((V(S2,G)>2.5) | (V(Qb,G)<2.5)),5,100m)
R1 Q N001 30
C1 Q G 100p IC=0
BQB1 N002 G V=If((V(R2,G)>2.5) | ((V(Q,G)<2.5) & (V(S2,G)<2.5)),5,100m)
R2 Qb N002 30
C2 Qb G 100p IC=5
BQ2 N005 G V=If((V(R1,G)<2.5) & ((V(S1,G)>2.5) | (V(Qb,G)<2.5)),5,100m)
R3 Q1 N005 100
C3 Q1 G 70p IC=0
BQB2 N006 G V=If((V(R1,G)>2.5) | ((V(Q1,G)<2.5) & (V(S1,G)<2.5)),5,100m)
R4 QB1 N006 100
C4 QB1 G 70p IC=5
* 20-ns delay in A8 to fix a logic
* glitch when the two flip-flops toggle.
.ends d_flipflop_g

.model D D
.lib standard.dio
.model NPN NPN
.model PNP PNP
.lib standard.bjt
*
.param Vin=10
.param Vout=5
.param L=8u
.param Ri=40m
*
.param Gfc=-12 ; magnitude at crossover
.param PS=-125 ; phase lag at crossover
*
* Enter Design Goals Information Here *
*
.param fc=10k ; targeted crossover
.param PM=60 ; choose phase margin at crossover
*
* Enter the Values for Vout and Bridge Bias Current *
*
.param Ibias=1m
.param Rlower={Vref/Ibias}
.param Rupper={(Vout-Vref)/Ibias}
*
* Capture the double zero position and one of the pole position *
*
.param fz1=2.8k
.param fz2=2k
.param fp2=50k
*
* Do not edit the below lines *
*
.param boost={PM-PS-90}
.param G={10**(-Gfc/20)}
.param fp1={fc/tan(atan(fc/fz1)+atan(fc/fz2)-atan(fc/fp2)-boost*pi/180)}
*
 * adjust second pole for targeted boost *
*
.param a={sqrt((fc**2/fp1**2)+1)}
.param b={sqrt((fc**2/fp2**2)+1)}
.param c={sqrt((fz1**2/fc**2)+1)}
.param d={sqrt((fc**2/fz2**2)+1)}
.param R2={((a*b/(c*d))/(fp1-fz1))*Rupper*G*fp1}
.param C1={1/(2*pi*fz1*R2)}
.param C2={C1/(C1*R2*2*pi*fp1-1)}
.param C3={(fp2-fz2)/(2*pi*Rupper*fp2*fz2)}
.param R3={Rupper*fz2/(fp2-fz2)}
.param G0={((R2*C1)/(Rupper*(C1+C2)))*c*d/(a*b)} ; Gain at fc sanity check
*
*
*
.param P=50
.param step=30 ; if step=30, then load is first 70% then goes 100%
.param RL1={Vout**2/(P*(1-step/100))} ; first load
.param RL2={Vout**2/(P*(step/100))} ; final load
.param Rload={Vout**2/P} ; nominal 100% load
*
*
.param Fsw=100k ; switching frequency
.param Tsw={1/Fsw}
.param VDRV=12 ; drive output voltage
.param Imax=0.5 ; current sense limit
*
*
* Internal PWM Model specifications
*
.param AOL=90 ; open-loop gain
.param GAIN={10**(AOL/20)}
.param pole=30 ; low-frequency pole
.param Isink=20m ; sink capability
.param Isource=500u ; source capability
.param VOL=100m ; low-level voltage
.param VOH=6 ; high-level voltage
*
.param Vv=0
.param Vp=2 ; sawtooth amplitude
.param Vref=2.5 ; internal voltage reference
.param Tss=1m ; internal soft-start duration
*
*
*
.model DBUCK D TT=10n Rs=10m Cjo=120p N=0.6 BV=150
.model TOFSW SW (Ron=25m Roff=10Meg Vt=2 Vh=1)
*
.tran 0 6m 4.5m uic
.options abstol=1u vntol=1m reltol=0.01 gmin=100p
+method=gear
.backanno
.end